# Altium schematic sheet BLE_breakout.SchDoc
size A
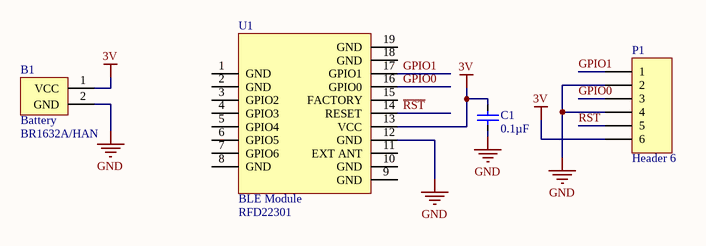
[diagram p0: BLE_breakout.SchDoc]

## Parts
B1  Battery  Manufacturer Part Number: BR1632A/HAN  [Battery_type1]
C1  Capacitance: 0.1µF  [CAPC1608N]  (hidden comment: Cap 0.1µF)
P1  Header 6  [HDR1X6]
U1  BLE Module  Manufacturer Part Number: RFD22301  [BLE_module]

## Nets
3V: B1.1(VCC) C1.2 P1.6 U1.13(VCC)
GND: B1.2(GND) C1.1 P1.2 P1.4 U1.12(GND)
GPIO0: P1.3 U1.16(GPIO0)
GPIO1: P1.1 U1.17(GPIO1)
~{RST}: P1.5 U1.14(RESET)

Not connected (* = marked no-connect by the designer): U1 1(GND) 2(GND) 3(GPIO2) 4(GPIO3) 5(GPIO4) 6(GPIO5) 7(GPIO6) 8(GND) 9(GND) 10(GND) 11(EXT_ANT) 15(FACTORY) 18(GND) 19(GND)

## Library data of the parts
B1 = Battery: Manufacturer: Panasonic; Capacity: 120mAh; Output Voltage: 3V; Chemistry/Technology: Lithium; Supplier 1: Newark; Stock 1: 129; Pricing 1: 1=3.3, 5=2.81, 10=2.64, 25=2.43, 50=2.19, 100=1.98, 250=1.77 (USD); Number of Pins: 2; Weight: 1.5g; Min Operating Temperature: -30°C; Max Operating Temperature: 80°C; Package Quantity: 30; Lead Free: Lead Free; ComponentLink1URL: https://datasheet.ciiva.com/14617/70196958-14617420.pdf; ComponentLink1Description: https://datasheet.ciiva.com/14617/70196958-14617420.pdf; Supplier Part Number 1: 40T0041
C1 = Cap 0.1µF: CAP CER 0.1UF 16V X7R 0603; Manufacturer: Yageo; Manufacturer Part Number: CC0603KRX7R7BB104; Tolerance: ±10%; Supplier 1: Digi-Key; Supplier Part Number 1: 311-1088-1-ND; RoHS: RoHS Compliant; Category: Capacitors; Stock 1: 3332544; Pricing 1: 1=0.1, 10=0.021, 100=0.0095, 500=0.00676, 1000=0.00531 (USD); Packaging: Cut Tape (CT); Part Status: Active; Voltage - Rated: 16V; Temperature Coefficient: X7R; Operating Temperature: -55°C ~ 125°C; Features: -; Ratings: -; Applications: General Purpose; Failure Rate: -; Mounting Type: Surface Mount, MLCC; Package / Case: 0603 (1608 Metric); Size / Dimension: 0.063" L x 0.031" W (1.60mm x 0.80mm); Height - Seated (Max): -; Thickness (Max): 0.035" (0.90mm); Lead Spacing: -; Lead Style: -; ComponentLink1URL: http://www.yageo.com/documents/recent/UPY-GPHC_X7R_6.3V-to-50V_18.pdf; ComponentLink1Description: http://www.yageo.com/documents/recent/UPY-GPHC_X7R_6.3V-to-50V_18.pdf
P1 = Header 6: Header, 6-Pin; LatestRevisionDate: 17-Jul-2002; LatestRevisionNote: Re-released for DXP Platform.; Publisher: Altium Limited
U1 = BLE Module: Manufacturer: RF Digital; Data Rate: 8Mbps; Frequency: 2.4GHz; Sensitivity: -93dBm; Interface: SPI,UART; Current - Receiving: 12mA; Operating Supply Voltage: 3V; Supplier 1: RSComponents; Stock 1: 0; Mount: Surface Mount; Case/Package: SMD/SMT; Min Operating Temperature: -25°C; Max Operating Temperature: 75°C; Packaging: Tray; Package Quantity: 90; Current - Transmitting: 12mA; ComponentLink1URL: https://datasheet.ciiva.com/24153/rfd22301-data-sheet-11-24-13-11-38pm-24153411.pdf; ComponentLink1Description: https://datasheet.ciiva.com/24153/rfd22301-data-sheet-11-24-13-11-38pm-24153411.pdf; Supplier Part Number 1: 801-1689